# EAGLE design ir-sensor-breakout-mk-3.0-pth (EAGLE 6.5.0)
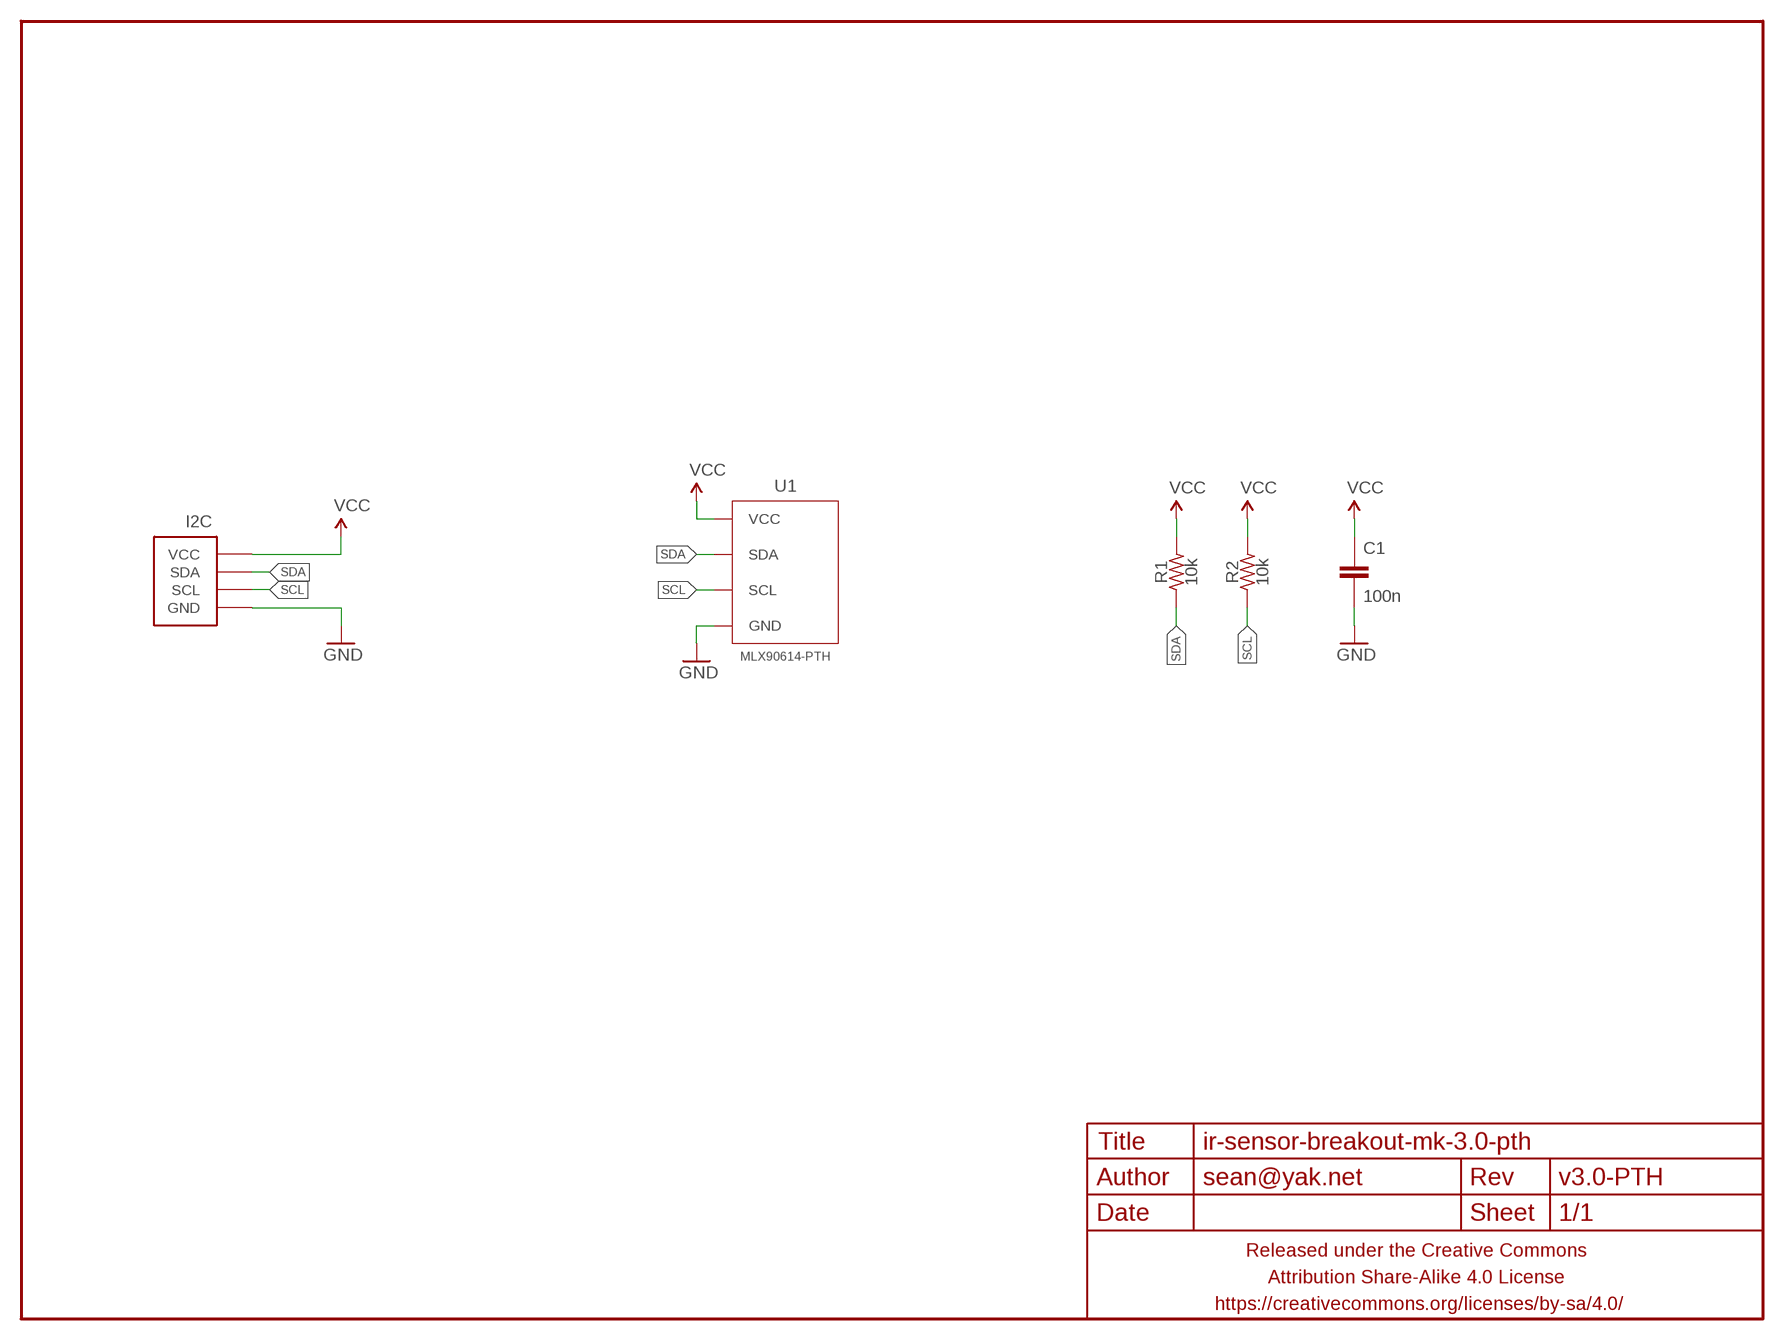
[diagram p0: schematic, sheet 1]

## Parts
C1  100n  CAPACITOR-CERAMIC025-024X044  [C025-024X044]
FRAME1  FRAME-LETTERNO_PACKAGE  [DUMMY]
I2C  M04-I2CPTH-0.1IN-CENTERED-FLIPPED  [1X04-PTH-VERT-I2C-CENTERED-FLIPPED]
R1  10k  RESISTORPTH-AXIAL-5.08MM  [RESISTOR-AXIAL-PTH-5.08MM]
R2  10k  RESISTORPTH-AXIAL-5.08MM  [RESISTOR-AXIAL-PTH-5.08MM]
U1  MLX90614-PTH  MLX906145V-PTH  [TO-39-4]

## Nets
GND: C1.2 I2C.GND U1.4(GND)
SCL: I2C.SCL R2.P$1 U1.1(SCL)
SDA: I2C.SDA R1.P$1 U1.2(SDA)
VCC: C1.1 I2C.VCC R1.P$2 R2.P$2 U1.3(VCC)

## Library data of the parts
C1 = A_butts:CAPACITOR-CERAMIC: CAPACITOR, European symbol
FRAME1 = A_butts:FRAME-LETTER: Schematic Frame Standard 8.5x11 US Letter frame; DESIGNER: sean@yak.net; VERSION: v3.0-PTH
I2C = A_butts:M04-I2C
R1 R2 = A_butts:RESISTOR: RESISTOR, American symbol
U1 = A_butts:MLX90614

## Board
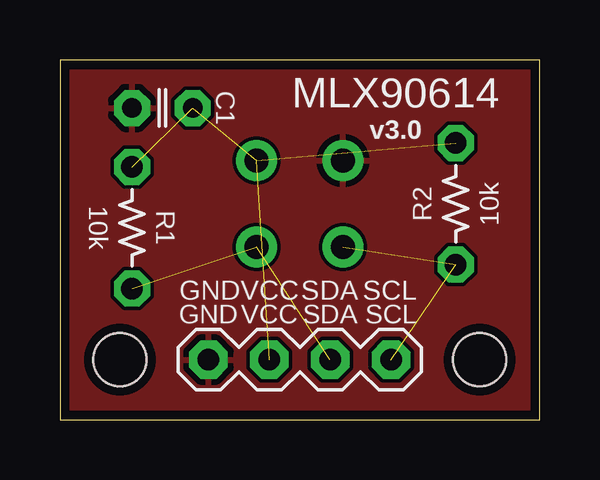
[diagram p1: board, top side]
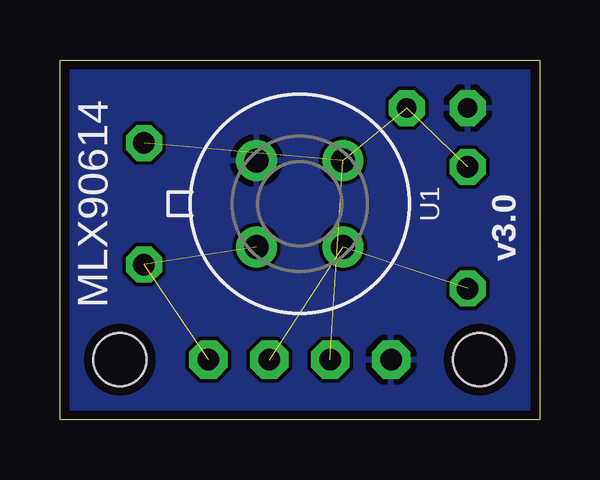
[diagram p2: board, bottom side, seen from below]

Size 20 x 15 mm. Coordinates in mm from the lower left corner, seen from the top.
Outline: 20,0 20,15 0,15 0,0 20,0
Copper layers (1*16): Top 0.0356mm / dielectric 1.5011mm / Bottom 0.0356mm
Design rules "LaenPCBOrder_2": minimum track width 6mil, minimum drill 13mil, track to track 6mil, track to pad 6mil, pad to pad 6mil, via to via 6mil, smd to smd 6mil, copper to edge 15mil, drill to drill 6mil, minimum pad ring 7mil, minimum via ring 7mil, stop-mask expansion 3mil, vias tented up to drill 20mil, thermal gap 10mil
Holes 2.2 mm at 17.5,2.5 2.5,2.5

### Footprints (pad centres in the part's own frame; a part is rotated, then mirrored left to right if it is on the bottom)
C025-024X044 = drill 0.813 pad 1.5 octagon: 1 -1.27,0; 2 1.27,0
1X04-PTH-VERT-I2C-CENTERED-FLIPPED = drill 0.9 pad 1.6 octagon: GND 3.81,0; SCL -3.81,0; SDA -1.27,0; VCC 1.27,0
RESISTOR-AXIAL-PTH-5.08MM = drill 0.9 pad 1.5 octagon: P$1 -2.54,0; P$2 2.54,0
TO-39-4 = drill 1 pad 1.7: 1 -1.8,1.8; 2 -1.8,-1.8; 3 1.8,-1.8; 4 1.8,1.8

### Placement (x,y rotation side)
C1  4.27,13 180 top
FRAME1  0,0 0 top
I2C  10,2.5 180 top
R1  3,8 90 top
R2  16.5,9 90 top
U1  10,9 90 bottom

### Tracks (layer width: path | path; a pad name or v marks a point on that pad's centre or on a via)
GND
  pour Top: 20,0 20,15 0,15 0,0
  pour Bottom: 0,15 20,15 20,0 0,0
SCL  (2 unrouted)
SDA  (2 unrouted)
VCC  (4 unrouted)

### Text on the board
tPlace: MLX90614 | GND | VCC | SDA | SCL
bPlace: MLX90614